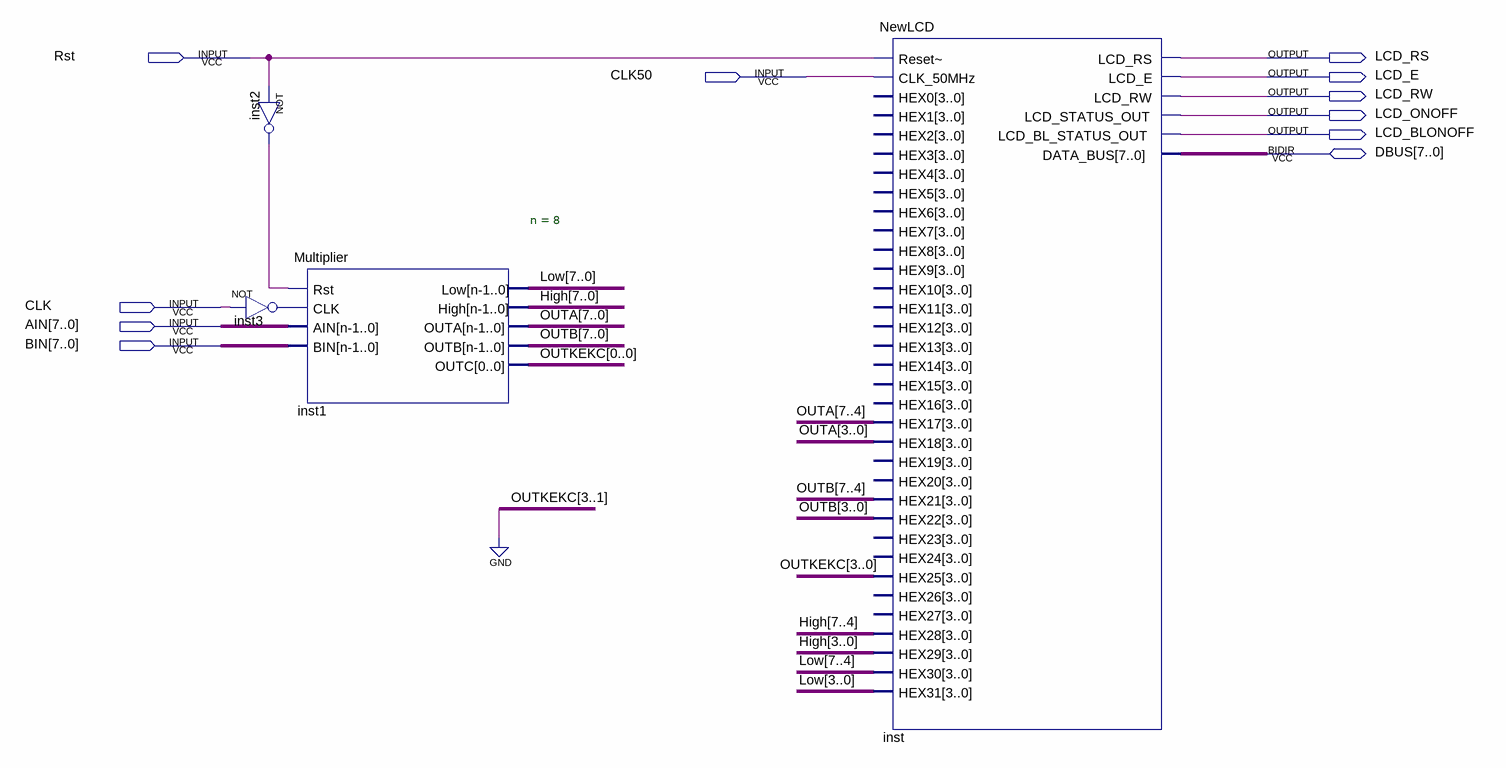
[diagram p0: schematic sheet]
// Quartus schematic Question1.bdf as structural Verilog: 4 symbols, 11 pins
module Question1 (
  input  Rst,
  input  CLK50,
  input  CLK,
  input  [7:0] AIN,
  input  [7:0] BIN,
  inout  [7:0] DBUS,
  output LCD_RS,
  output LCD_E,
  output LCD_RW,
  output LCD_ONOFF,
  output LCD_BLONOFF
);

  wire inst2_out, inst3_out;
  wire [3:0] OUTKEKC;
  wire [7:0] High, Low, OUTA, OUTB;

  not inst3 (inst3_out, CLK);
  not inst2 (inst2_out, Rst);
  Multiplier #(.n(8)) inst1 (
    .Rst(inst2_out), .CLK(inst3_out), .AIN(AIN), .BIN(BIN), .Low(Low), .High(High), .OUTA(OUTA), .OUTB(OUTB),
    .OUTC(OUTKEKC[0]));
  NewLCD inst (
    .\Reset~ (Rst), .CLK_50MHz(CLK50), .HEX17(OUTA[7:4]), .HEX18(OUTA[3:0]), .HEX21(OUTB[7:4]),
    .HEX22(OUTB[3:0]), .HEX25(OUTKEKC), .HEX28(High[7:4]), .HEX29(High[3:0]), .HEX30(Low[7:4]),
    .HEX31(Low[3:0]), .LCD_RS(LCD_RS), .LCD_E(LCD_E), .LCD_RW(LCD_RW), .LCD_STATUS_OUT(LCD_ONOFF),
    .LCD_BL_STATUS_OUT(LCD_BLONOFF), .DATA_BUS(DBUS));  // open: HEX0, HEX1, HEX2, HEX3, HEX4, HEX5, HEX6, HEX7, HEX8, HEX9, HEX10, HEX11, HEX12, HEX13, HEX14, HEX15, HEX16, HEX19, HEX20, HEX23, HEX24, HEX26, HEX27
endmodule
